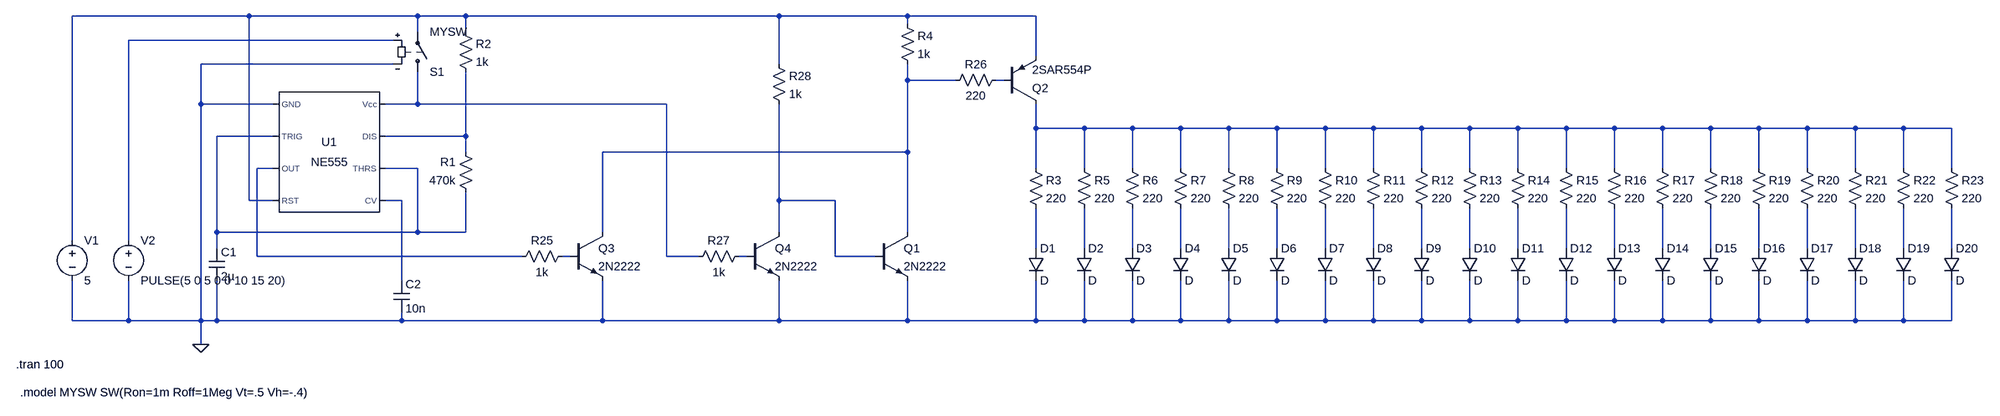
[diagram p0: schematic blink_circuit.asc]
blink_circuit.asc, the LTspice schematic file:
Version 4
SHEET 1 3540 680
WIRE 80 -416 -272 -416
WIRE 416 -416 80 -416
WIRE 512 -416 416 -416
WIRE 1136 -416 512 -416
WIRE 1392 -416 1136 -416
WIRE 1648 -416 1392 -416
WIRE 1392 -400 1392 -416
WIRE 416 -384 416 -416
WIRE 512 -384 512 -416
WIRE 368 -368 -160 -368
WIRE 1648 -336 1648 -416
WIRE 368 -320 -16 -320
WIRE 1136 -320 1136 -416
WIRE 1392 -288 1392 -320
WIRE 1488 -288 1392 -288
WIRE 1584 -288 1568 -288
WIRE -16 -240 -16 -320
WIRE 128 -240 -16 -240
WIRE 416 -240 416 -304
WIRE 416 -240 352 -240
WIRE 912 -240 416 -240
WIRE 1648 -192 1648 -240
WIRE 1744 -192 1648 -192
WIRE 1840 -192 1744 -192
WIRE 1936 -192 1840 -192
WIRE 2032 -192 1936 -192
WIRE 2128 -192 2032 -192
WIRE 2224 -192 2128 -192
WIRE 2320 -192 2224 -192
WIRE 2416 -192 2320 -192
WIRE 2512 -192 2416 -192
WIRE 2608 -192 2512 -192
WIRE 2704 -192 2608 -192
WIRE 2800 -192 2704 -192
WIRE 2896 -192 2800 -192
WIRE 2992 -192 2896 -192
WIRE 3088 -192 2992 -192
WIRE 3184 -192 3088 -192
WIRE 3280 -192 3184 -192
WIRE 3376 -192 3280 -192
WIRE 3472 -192 3376 -192
WIRE 128 -176 16 -176
WIRE 512 -176 512 -304
WIRE 512 -176 352 -176
WIRE 512 -144 512 -176
WIRE 1392 -144 1392 -288
WIRE 1392 -144 784 -144
WIRE 128 -112 96 -112
WIRE 416 -112 352 -112
WIRE 1648 -112 1648 -192
WIRE 1744 -112 1744 -192
WIRE 1840 -112 1840 -192
WIRE 1936 -112 1936 -192
WIRE 2032 -112 2032 -192
WIRE 2128 -112 2128 -192
WIRE 2224 -112 2224 -192
WIRE 2320 -112 2320 -192
WIRE 2416 -112 2416 -192
WIRE 2512 -112 2512 -192
WIRE 2608 -112 2608 -192
WIRE 2704 -112 2704 -192
WIRE 2800 -112 2800 -192
WIRE 2896 -112 2896 -192
WIRE 2992 -112 2992 -192
WIRE 3088 -112 3088 -192
WIRE 3184 -112 3184 -192
WIRE 3280 -112 3280 -192
WIRE 3376 -112 3376 -192
WIRE 3472 -112 3472 -192
WIRE 80 -48 80 -416
WIRE 128 -48 80 -48
WIRE 384 -48 352 -48
WIRE 1136 -48 1136 -240
WIRE 1248 -48 1136 -48
WIRE 16 16 16 -176
WIRE 416 16 416 -112
WIRE 416 16 16 16
WIRE 512 16 512 -64
WIRE 512 16 416 16
WIRE 784 16 784 -144
WIRE 1136 16 1136 -48
WIRE 1392 16 1392 -144
WIRE -272 32 -272 -416
WIRE -160 32 -160 -368
WIRE 16 48 16 16
WIRE 1648 48 1648 -32
WIRE 1744 48 1744 -32
WIRE 1840 48 1840 -32
WIRE 1936 48 1936 -32
WIRE 2032 48 2032 -32
WIRE 2128 48 2128 -32
WIRE 2224 48 2224 -32
WIRE 2320 48 2320 -32
WIRE 2416 48 2416 -32
WIRE 2512 48 2512 -32
WIRE 2608 48 2608 -32
WIRE 2704 48 2704 -32
WIRE 2800 48 2800 -32
WIRE 2896 48 2896 -32
WIRE 2992 48 2992 -32
WIRE 3088 48 3088 -32
WIRE 3184 48 3184 -32
WIRE 3280 48 3280 -32
WIRE 3376 48 3376 -32
WIRE 3472 48 3472 -32
WIRE 96 64 96 -112
WIRE 624 64 96 64
WIRE 720 64 704 64
WIRE 912 64 912 -240
WIRE 976 64 912 64
WIRE 1072 64 1056 64
WIRE 1248 64 1248 -48
WIRE 1328 64 1248 64
WIRE 384 112 384 -48
WIRE -272 192 -272 112
WIRE -160 192 -160 112
WIRE -160 192 -272 192
WIRE -16 192 -16 -240
WIRE -16 192 -160 192
WIRE 16 192 16 112
WIRE 16 192 -16 192
WIRE 384 192 384 176
WIRE 384 192 16 192
WIRE 784 192 784 112
WIRE 784 192 384 192
WIRE 1136 192 1136 112
WIRE 1136 192 784 192
WIRE 1392 192 1392 112
WIRE 1392 192 1136 192
WIRE 1648 192 1648 112
WIRE 1648 192 1392 192
WIRE 1744 192 1744 112
WIRE 1744 192 1648 192
WIRE 1840 192 1840 112
WIRE 1840 192 1744 192
WIRE 1936 192 1936 112
WIRE 1936 192 1840 192
WIRE 2032 192 2032 112
WIRE 2032 192 1936 192
WIRE 2128 192 2128 112
WIRE 2128 192 2032 192
WIRE 2224 192 2224 112
WIRE 2224 192 2128 192
WIRE 2320 192 2320 112
WIRE 2320 192 2224 192
WIRE 2416 192 2416 112
WIRE 2416 192 2320 192
WIRE 2512 192 2512 112
WIRE 2512 192 2416 192
WIRE 2608 192 2608 112
WIRE 2608 192 2512 192
WIRE 2704 192 2704 112
WIRE 2704 192 2608 192
WIRE 2800 192 2800 112
WIRE 2800 192 2704 192
WIRE 2896 192 2896 112
WIRE 2896 192 2800 192
WIRE 2992 192 2992 112
WIRE 2992 192 2896 192
WIRE 3088 192 3088 112
WIRE 3088 192 2992 192
WIRE 3184 192 3184 112
WIRE 3184 192 3088 192
WIRE 3280 192 3280 112
WIRE 3280 192 3184 192
WIRE 3376 192 3376 112
WIRE 3376 192 3280 192
WIRE 3472 192 3472 112
WIRE 3472 192 3376 192
WIRE -16 240 -16 192
FLAG -16 240 0
SYMBOL Misc\\NE555 240 -144 R0
SYMATTR InstName U1
SYMBOL voltage -272 16 R0
WINDOW 123 0 0 Left 0
WINDOW 39 0 0 Left 0
SYMATTR InstName V1
SYMATTR Value 5
SYMBOL cap 0 48 R0
SYMATTR InstName C1
SYMATTR Value 2µ
SYMBOL res 528 -48 R180
WINDOW 0 36 76 Left 2
WINDOW 3 36 40 Left 2
SYMATTR InstName R1
SYMATTR Value 470k
SYMBOL res 496 -400 R0
SYMATTR InstName R2
SYMATTR Value 1k
SYMBOL res 1632 -128 R0
SYMATTR InstName R3
SYMATTR Value 220
SYMBOL diode 1632 48 R0
SYMATTR InstName D1
SYMBOL cap 368 112 R0
SYMATTR InstName C2
SYMATTR Value 10n
SYMBOL res 1728 -128 R0
SYMATTR InstName R5
SYMATTR Value 220
SYMBOL diode 1728 48 R0
SYMATTR InstName D2
SYMBOL res 1824 -128 R0
SYMATTR InstName R6
SYMATTR Value 220
SYMBOL diode 1824 48 R0
SYMATTR InstName D3
SYMBOL res 1920 -128 R0
SYMATTR InstName R7
SYMATTR Value 220
SYMBOL diode 1920 48 R0
SYMATTR InstName D4
SYMBOL res 2016 -128 R0
SYMATTR InstName R8
SYMATTR Value 220
SYMBOL diode 2016 48 R0
SYMATTR InstName D5
SYMBOL res 2112 -128 R0
SYMATTR InstName R9
SYMATTR Value 220
SYMBOL diode 2112 48 R0
SYMATTR InstName D6
SYMBOL res 2208 -128 R0
SYMATTR InstName R10
SYMATTR Value 220
SYMBOL diode 2208 48 R0
SYMATTR InstName D7
SYMBOL res 2304 -128 R0
SYMATTR InstName R11
SYMATTR Value 220
SYMBOL diode 2304 48 R0
SYMATTR InstName D8
SYMBOL res 2400 -128 R0
SYMATTR InstName R12
SYMATTR Value 220
SYMBOL diode 2400 48 R0
SYMATTR InstName D9
SYMBOL res 2496 -128 R0
SYMATTR InstName R13
SYMATTR Value 220
SYMBOL diode 2496 48 R0
SYMATTR InstName D10
SYMBOL res 2592 -128 R0
SYMATTR InstName R14
SYMATTR Value 220
SYMBOL diode 2592 48 R0
SYMATTR InstName D11
SYMBOL res 2688 -128 R0
SYMATTR InstName R15
SYMATTR Value 220
SYMBOL diode 2688 48 R0
SYMATTR InstName D12
SYMBOL res 2784 -128 R0
SYMATTR InstName R16
SYMATTR Value 220
SYMBOL diode 2784 48 R0
SYMATTR InstName D13
SYMBOL res 2880 -128 R0
SYMATTR InstName R17
SYMATTR Value 220
SYMBOL diode 2880 48 R0
SYMATTR InstName D14
SYMBOL res 2976 -128 R0
SYMATTR InstName R18
SYMATTR Value 220
SYMBOL diode 2976 48 R0
SYMATTR InstName D15
SYMBOL res 3072 -128 R0
SYMATTR InstName R19
SYMATTR Value 220
SYMBOL diode 3072 48 R0
SYMATTR InstName D16
SYMBOL res 3168 -128 R0
SYMATTR InstName R20
SYMATTR Value 220
SYMBOL diode 3168 48 R0
SYMATTR InstName D17
SYMBOL res 3264 -128 R0
SYMATTR InstName R21
SYMATTR Value 220
SYMBOL diode 3264 48 R0
SYMATTR InstName D18
SYMBOL res 3360 -128 R0
SYMATTR InstName R22
SYMATTR Value 220
SYMBOL diode 3360 48 R0
SYMATTR InstName D19
SYMBOL res 3456 -128 R0
SYMATTR InstName R23
SYMATTR Value 220
SYMBOL diode 3456 48 R0
SYMATTR InstName D20
SYMBOL pnp 1584 -240 M180
SYMATTR InstName Q2
SYMATTR Value 2SAR554P
SYMBOL sw 416 -288 M180
SYMATTR InstName S1
SYMATTR Value MYSW
SYMBOL voltage -160 16 R0
WINDOW 123 0 0 Left 0
WINDOW 39 0 0 Left 0
SYMATTR InstName V2
SYMATTR Value PULSE(5 0 5 0 0 10 15 20)
SYMBOL npn 1328 16 R0
SYMATTR InstName Q1
SYMATTR Value 2N2222
SYMBOL npn 720 16 R0
SYMATTR InstName Q3
SYMATTR Value 2N2222
SYMBOL res 720 48 R90
WINDOW 0 0 56 VBottom 2
WINDOW 3 32 56 VTop 2
SYMATTR InstName R25
SYMATTR Value 1k
SYMBOL res 1584 -304 R90
WINDOW 0 0 56 VBottom 2
WINDOW 3 32 56 VTop 2
SYMATTR InstName R26
SYMATTR Value 220
SYMBOL npn 1072 16 R0
SYMATTR InstName Q4
SYMATTR Value 2N2222
SYMBOL res 1072 48 R90
WINDOW 0 0 56 VBottom 2
WINDOW 3 32 56 VTop 2
SYMATTR InstName R27
SYMATTR Value 1k
SYMBOL res 1120 -336 R0
SYMATTR InstName R28
SYMATTR Value 1k
SYMBOL res 1376 -416 R0
SYMATTR InstName R4
SYMATTR Value 1k
TEXT -384 280 Left 2 !.tran 100
TEXT -376 336 Left 2 !.model MYSW SW(Ron=1m Roff=1Meg Vt=.5 Vh=-.4)

The netlist it stands for:
* blink_circuit.asc
XU1 0 N007 N009 N001 N010 N007 N008 N005 NE555  ; pins GND TRIG OUT RST CV THRS DIS Vcc
V1 N001 0 5
C1 N007 0 2µ
R1 N007 N008 470k
R2 N001 N008 1k
R3 N006 N012 220
D1 N012 0 D
C2 N010 0 10n
R5 N006 N013 220
D2 N013 0 D
R6 N006 N014 220
D3 N014 0 D
R7 N006 N015 220
D4 N015 0 D
R8 N006 N016 220
D5 N016 0 D
R9 N006 N017 220
D6 N017 0 D
R10 N006 N018 220
D7 N018 0 D
R11 N006 N019 220
D8 N019 0 D
R12 N006 N020 220
D9 N020 0 D
R13 N006 N021 220
D10 N021 0 D
R14 N006 N022 220
D11 N022 0 D
R15 N006 N023 220
D12 N023 0 D
R16 N006 N024 220
D13 N024 0 D
R17 N006 N025 220
D14 N025 0 D
R18 N006 N026 220
D15 N026 0 D
R19 N006 N027 220
D16 N027 0 D
R20 N006 N028 220
D17 N028 0 D
R21 N006 N029 220
D18 N029 0 D
R22 N006 N030 220
D19 N030 0 D
R23 N006 N031 220
D20 N031 0 D
Q2 N006 N004 N001 0 2SAR554P
S1 N005 N001 N002 0 MYSW
V2 N002 0 PULSE(5 0 5 0 0 10 15 20)
Q1 N003 N011 0 0 2N2222
Q3 N003 N032 0 0 2N2222
R25 N032 N009 1k
R26 N004 N003 220
Q4 N011 N033 0 0 2N2222
R27 N033 N005 1k
R28 N001 N011 1k
R4 N001 N003 1k
.model D D
.lib standard.dio
.model NPN NPN
.model PNP PNP
.lib standard.bjt
.tran 100
.model MYSW SW(Ron=1m Roff=1Meg Vt=.5 Vh=-.4)
.lib NE555.sub
.backanno
.end